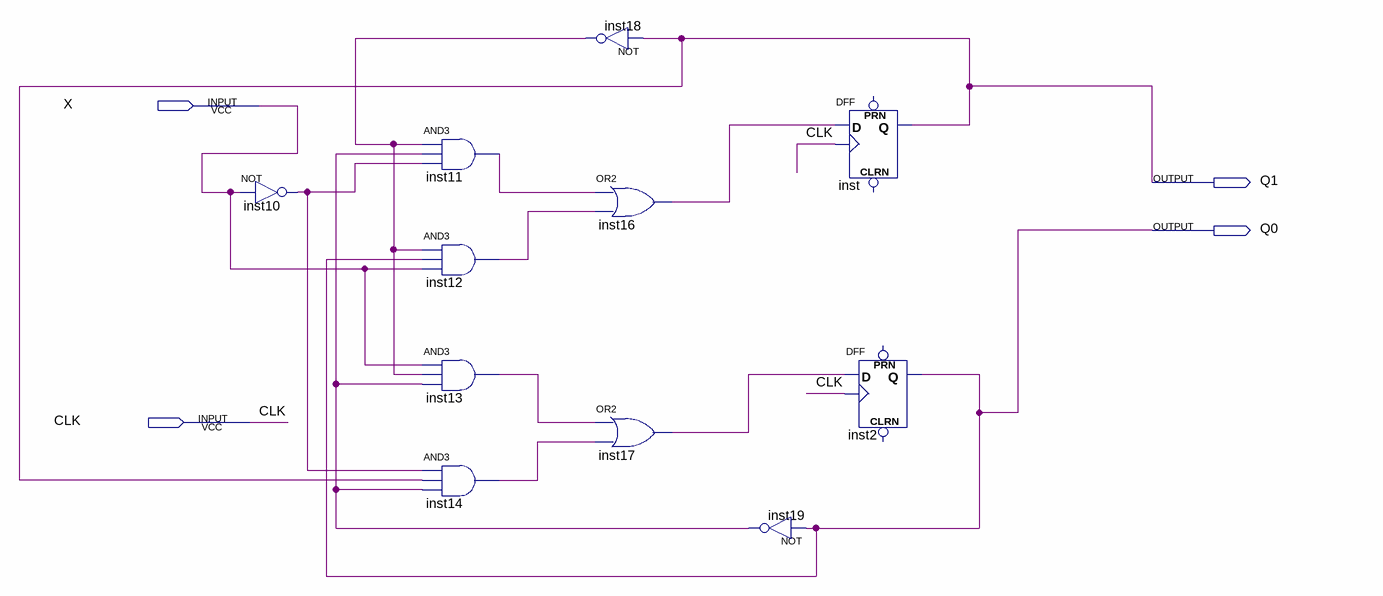
[diagram p0: schematic sheet]
// Quartus schematic Maquina_de_estado_TP2.bdf as structural Verilog: 11 symbols, 4 pins
module Maquina_de_estado_TP2 (
  input  X,
  input  CLK,
  output Q1,
  output Q0
);

  wire inst10_out, inst11_out, inst12_out, inst13_out, inst14_out, inst16_out, inst17_out, inst18_out,
       inst19_out;

  not inst10 (inst10_out, X);
  and inst11 (inst11_out, inst18_out, inst19_out, inst10_out);
  and inst12 (inst12_out, inst18_out, Q0, X);
  and inst13 (inst13_out, X, inst18_out, inst19_out);
  and inst14 (inst14_out, inst10_out, Q1, inst19_out);
  not inst18 (inst18_out, Q1);
  or inst16 (inst16_out, inst11_out, inst12_out);
  or inst17 (inst17_out, inst13_out, inst14_out);
  not inst19 (inst19_out, Q0);
  DFF inst (.CLK(CLK), .D(inst16_out), .Q(Q1));  // open: CLRN, PRN
  DFF inst2 (.CLK(CLK), .D(inst17_out), .Q(Q0));  // open: CLRN, PRN
endmodule
